# EasyEDA Pro project pro.epro

# Schematic Line follower
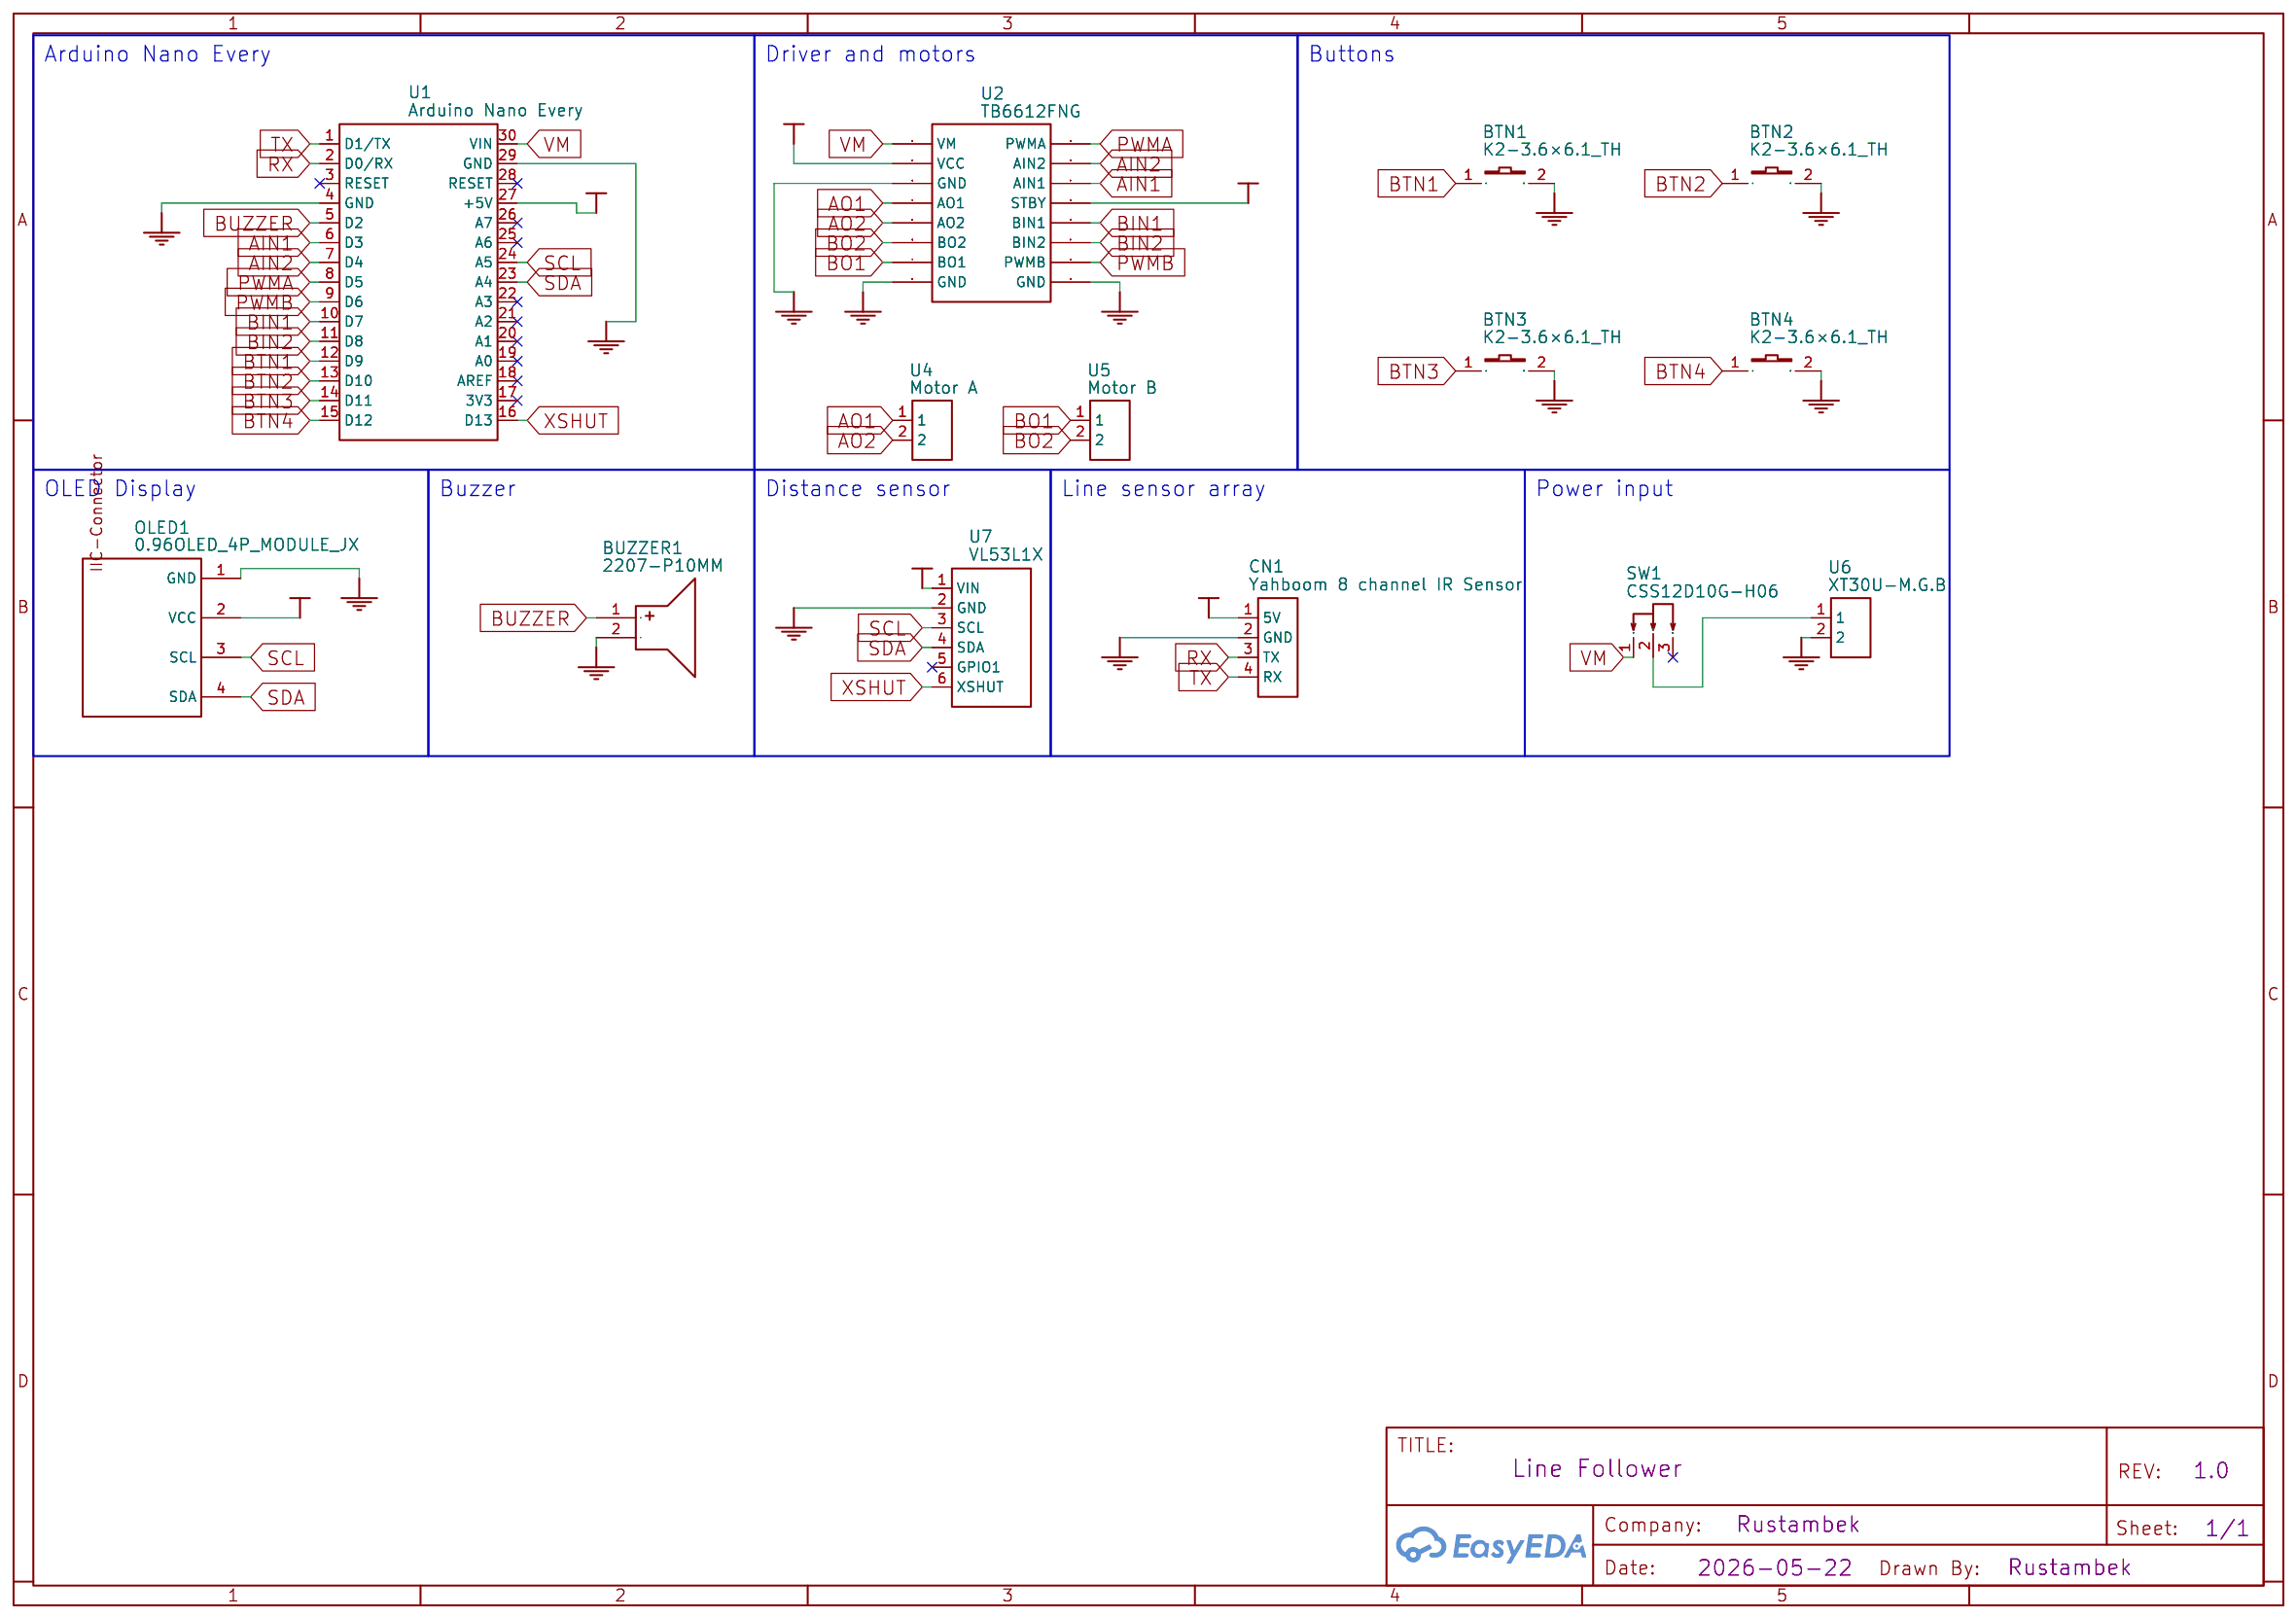
[diagram p0: schematic sheet]

## Parts
BTN1  K2-3.6×6.1_TH  [KEY-TH_2P]
BTN2  K2-3.6×6.1_TH  [KEY-TH_2P]
BTN3  K2-3.6×6.1_TH  [KEY-TH_2P]
BTN4  K2-3.6×6.1_TH  [KEY-TH_2P]
BUZZER1  2207-P10MM  [BUZZER_BEEPER:BUZZER_12X9.5RM7.6]
CN1  Yahboom 8 channel IR Sensor  [CONN-TH_PH2.0-4P]
OLED1  0.96OLED_4P_MODULE_JX  [0.96OLED_4P]
SW1  CSS12D10G-H06  [SW-TH_3P-P4.80-HX-SS12D10G4]
U1  Arduino Nano Every  [COMM-TH_ARDUINO_NANO]
U2  TB6612FNG  [TB6612-BOARD]
U4  Motor A  [CONN-TH_2P-P2.50-XH2.54-2P]
U5  Motor B  [CONN-TH_2P-P2.50-XH2.54-2P]
U6  XT30U-M.G.B  [CONN-TH_XT30U-M]
U7  VL53L1X  [CONN-TH_B6B-XH-A-GU]

## Library data of the parts
BTN1-BTN4 = K2-1107ST-A4SW-06: Supplier Part: C118141; Supplier: LCSC; 制造商: 韩国韩荣
BUZZER1 = 2207-P10MM: Supplier: LCSC; Supplier Part: C49246969; Manufacturer: XHXDZ(兴华鑫); JLCPCB Part Class: Extended Part
CN1 = PH2.0-4P: Supplier: LCSC; Supplier Part: C722763; Manufacturer: CAX(创都); JLCPCB Part Class: Extended Part
OLED1 = 0.96OLED_4P_MODULE_JX: Supplier: LCSC; Supplier Part: C9900004566; Manufacturer: null; JLCPCB Part Class: Extended Part
SW1 = CSS12D10G-H06: Supplier: LCSC; Supplier Part: C49435501; Manufacturer: JXTCONN(聚兴泰); JLCPCB Part Class: Extended Part; Origin 3D Model Title: SW-TH_SHOU-HAN_SS12D10G4
U1 = ARDUINO_NANO: Supplier: LCSC; Supplier Part: C9900017879; Manufacturer: null; JLCPCB Part Class: Extended Part
U2 = TB6612FNG
U4 U5 = XH-2P-2.54: Supplier: LCSC; Supplier Part: C9900003929; Manufacturer: null; JLCPCB Part Class: Extended Part
U6 = XT30U-M.G.B: Supplier: LCSC; Supplier Part: C19268020; Manufacturer: AMASS(艾迈斯); JLCPCB Part Class: Extended Part
U7 = B6B-XH-A-GU: Supplier: LCSC; Supplier Part: C265366; Manufacturer: JST; JLCPCB Part Class: Extended Part

## Nets
GND: BTN1.2 BTN2.2 BTN3.2 BTN4.2 BUZZER1.2(-) CN1.2(GND) OLED1.1(GND) U1.4(GND) U1.29(GND) U2.3(GND) U2.8(GND) U2.9(GND) U6.2 U7.2(GND)
VCC: CN1.1(5V) OLED1.2(VCC) U1.27(+5V) U2.2(VCC) U2.13(STBY) U7.1(VIN)
AIN1: U1.6(D3) U2.14(AIN1)
AIN2: U1.7(D4) U2.15(AIN2)
AO1: U2.4(AO1) U4.1
AO2: U2.5(AO2) U4.2
BIN1: U1.10(D7) U2.12(BIN1)
BIN2: U1.11(D8) U2.11(BIN2)
BO1: U2.7(BO1) U5.1
BO2: U2.6(BO2) U5.2
BTN1: BTN1.1 U1.12(D9)
BTN2: BTN2.1 U1.13(D10)
BTN3: BTN3.1 U1.14(D11)
BTN4: BTN4.1 U1.15(D12)
BUZZER: BUZZER1.1(+) U1.5(D2)
PWMA: U1.8(D5) U2.16(PWMA)
PWMB: U1.9(D6) U2.10(PWMB)
RX: CN1.3(TX) U1.2(D0/RX)
SCL: OLED1.3(SCL) U1.24(A5) U7.3(SCL)
SDA: OLED1.4(SDA) U1.23(A4) U7.4(SDA)
TX: CN1.4(RX) U1.1(D1/TX)
VM: SW1.1 U1.30(VIN) U2.1(VM)
XSHUT: U1.16(D13) U7.6(XSHUT)
Net-(SW1-2): SW1.2 U6.1

Not connected (* = marked no-connect by the designer): SW1 3*; U1 3(RESET)* 17(3V3)* 18(AREF)* 19(A0)* 20(A1)* 21(A2)* 22(A3)* 25(A6)* 26(A7)* 28(RESET)*; U7 5(GPIO1)*

## Notes on the sheet
- Arduino Nano Every
- Driver and motors
- Buttons
- OLED Display
- Buzzer
- Distance sensor
- Line sensor array
- Power input

# Board pcb
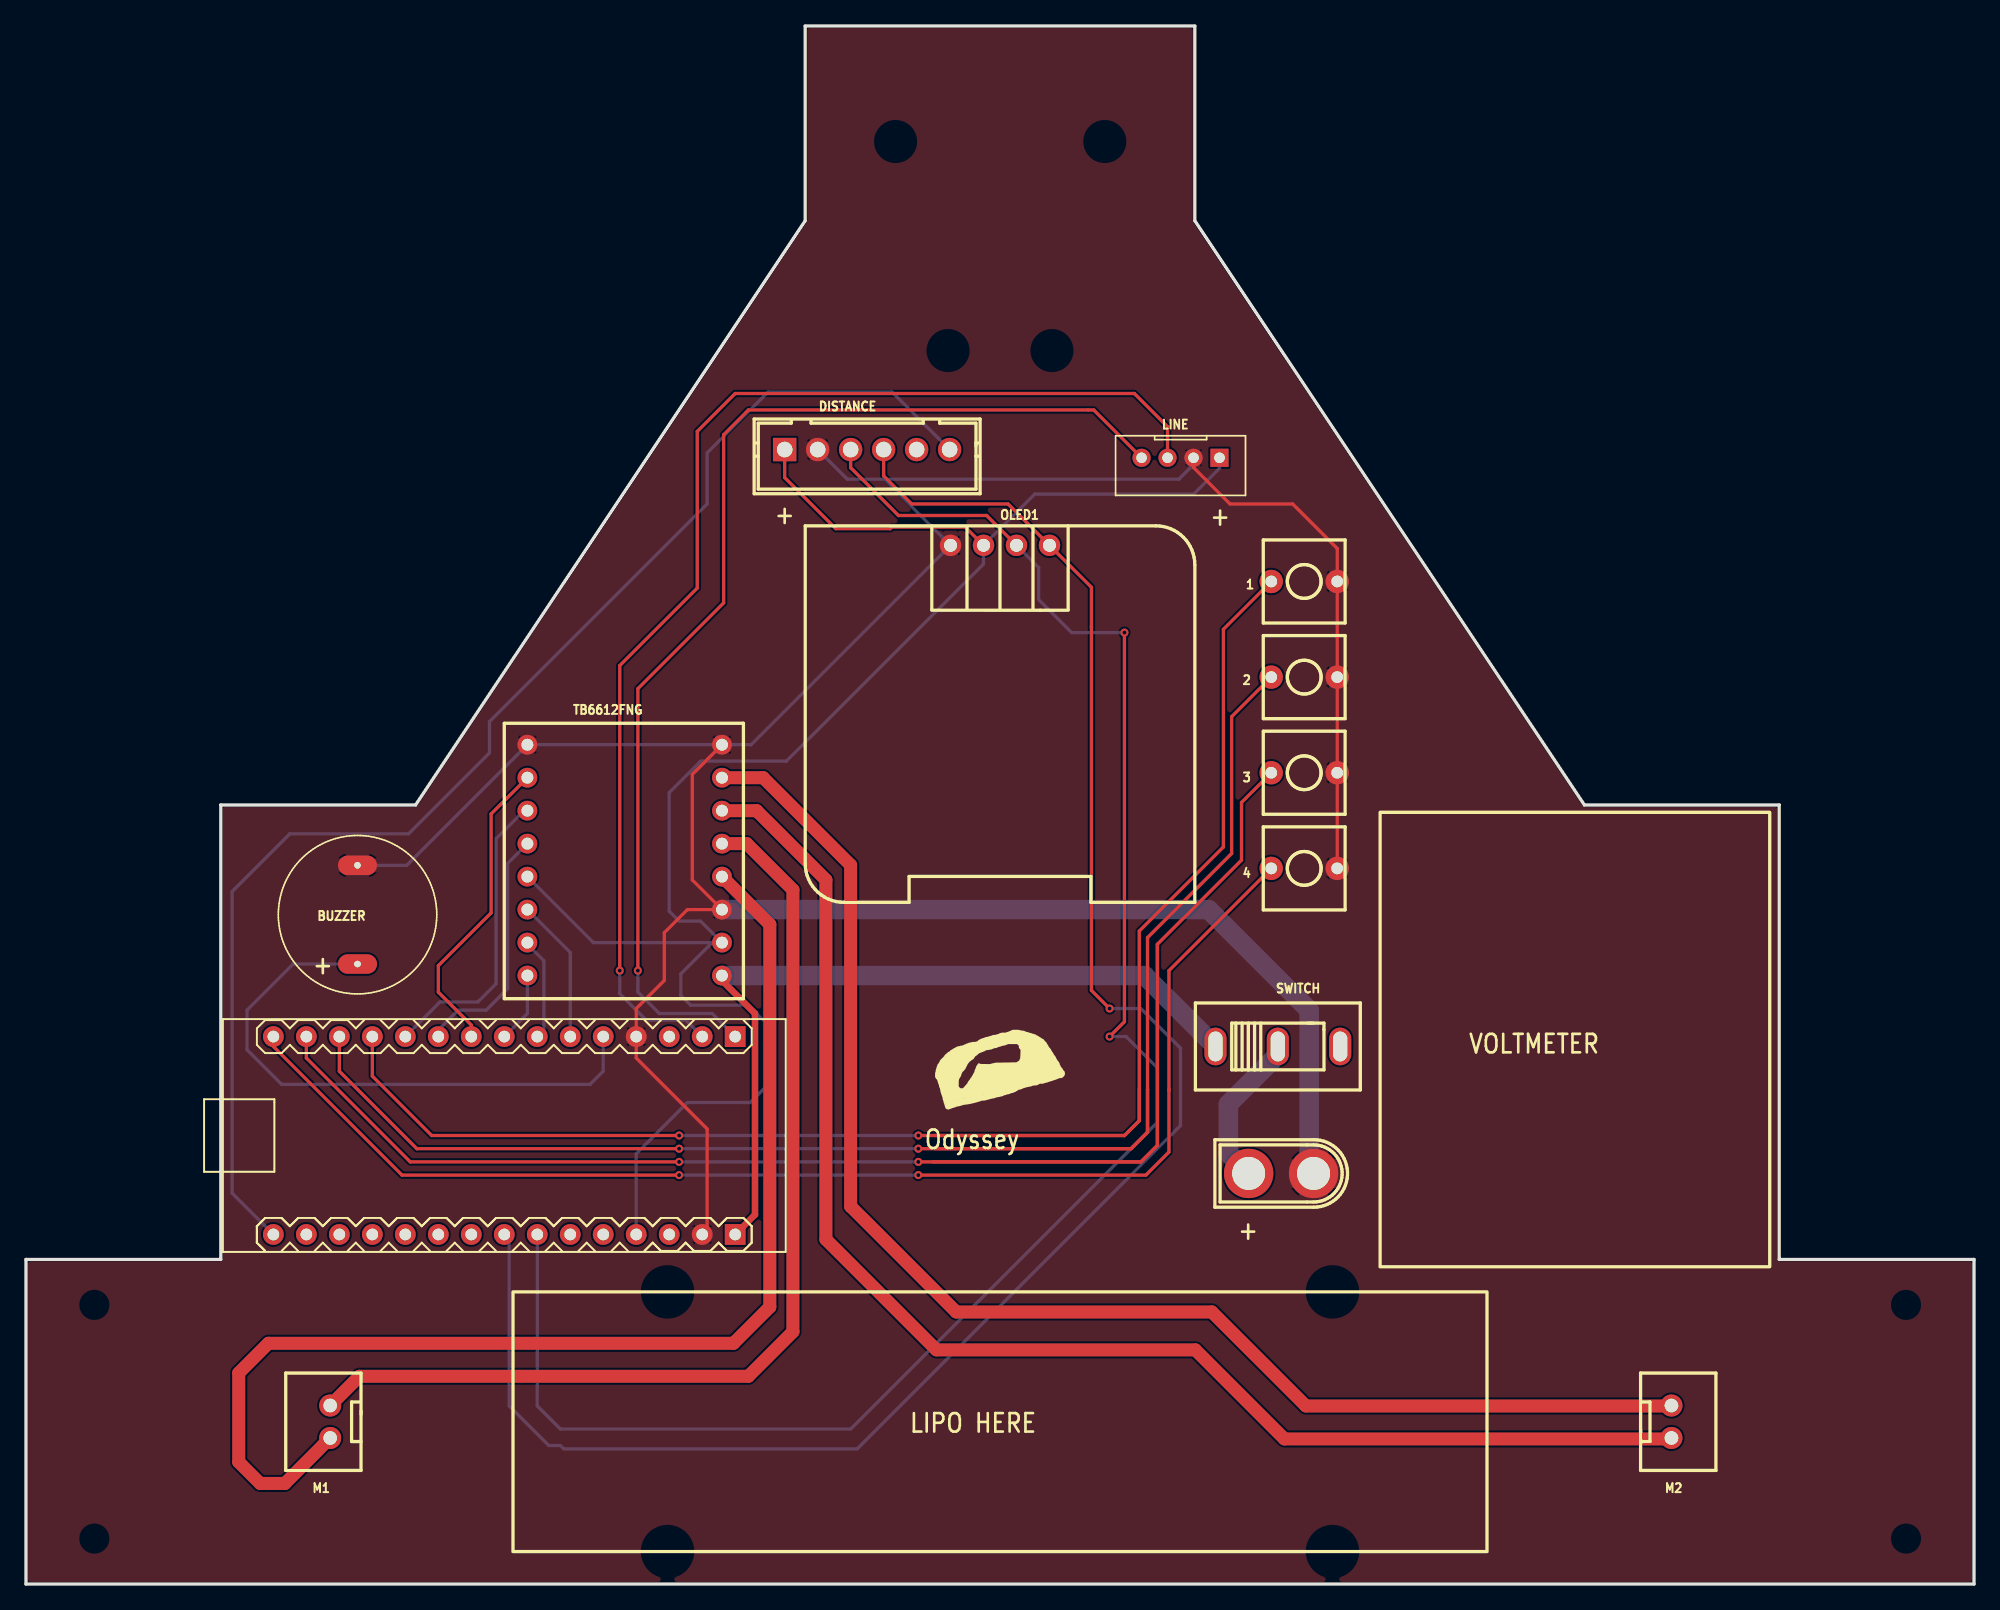
[diagram p1: board, top side]
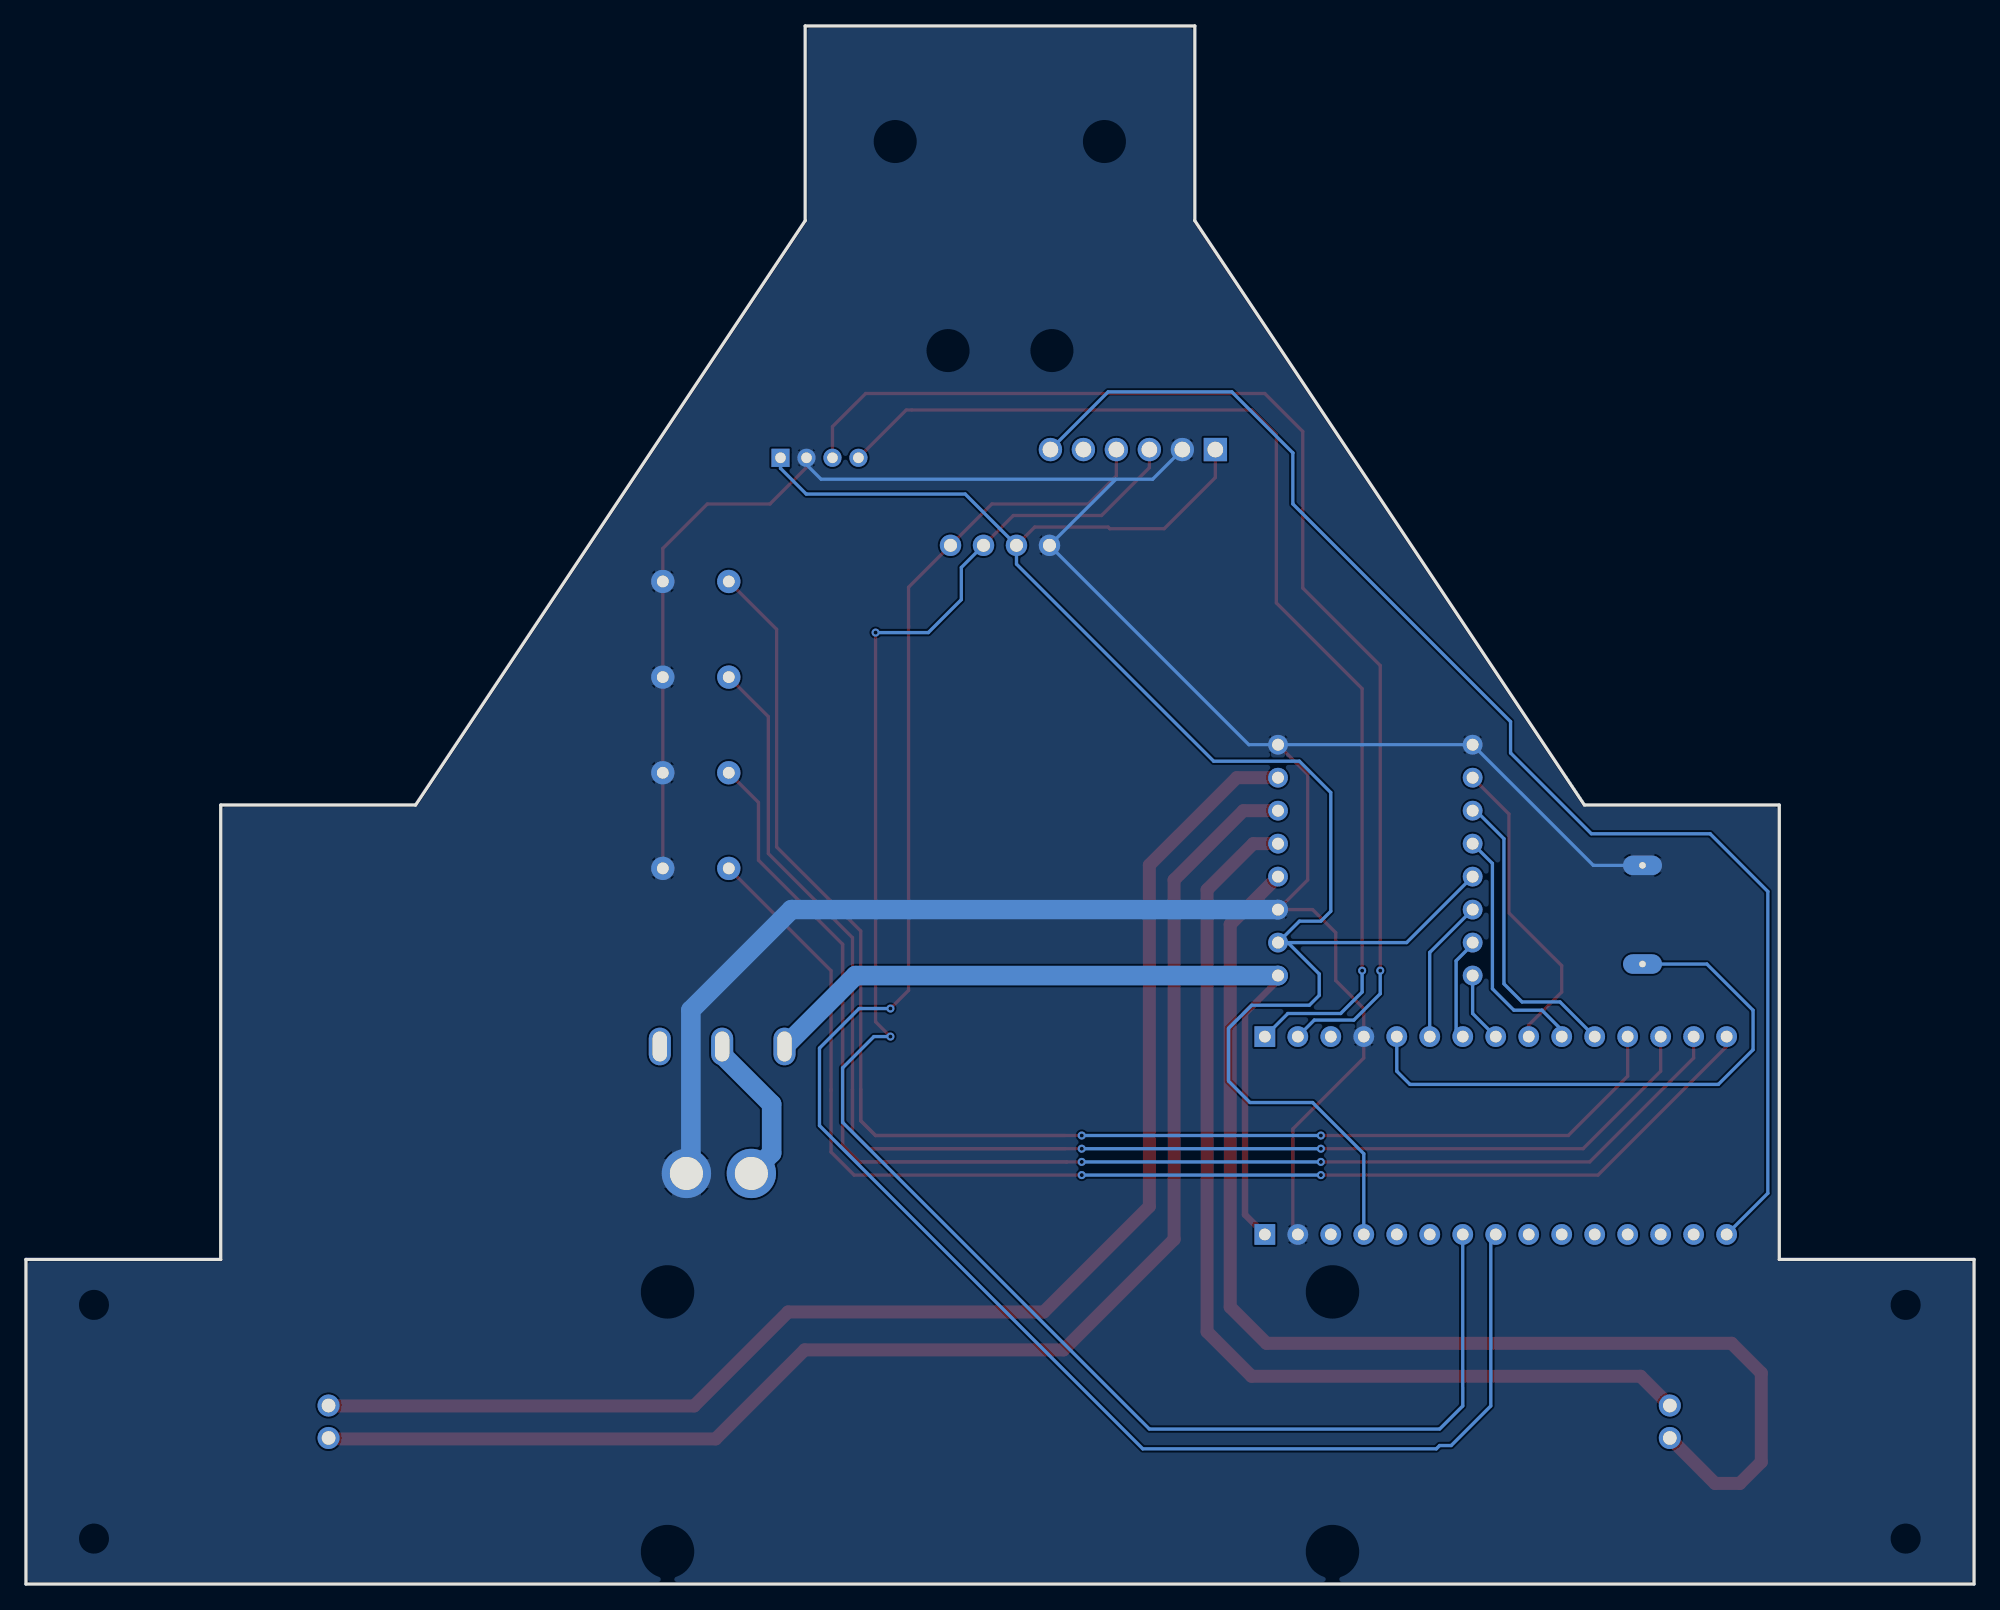
[diagram p2: board, bottom side, seen from below]

Outline 150 x 120 mm; copper layers: Top Layer, Bottom Layer. Coordinates in mm from the lower left corner of the outline.
Outline path: 0,25 0,0 150,0 150,25 135,25 135,60 120,60 90,105 90,120 60,120 60,105 30,60 15,60 15,25 0,25
Stack: Top Layer 0.035mm / Bottom Layer 0.035mm

## Design rules (mm)
spacing Default (default): track to track 0.102, other pairs 0 to 0.3
spacing Lipo: track to track 0.102, other pairs 0 to 0.3
spacing Motor: track to track 0.102, other pairs 0 to 0.3
track width Default (default): min 0.254, default 0.254, max 25.4
track width Lipo: min 1.5, default 1.5, max 25.4
track width Motor: min 1, default 1, max 25.4
differential pair differentialPair (default): width min 0.127, default 2.54, max 2.54; gap min 0.127, default 0.152

## Placement (name value [footprint] x y rotation side)
1  K2-3.6×6.1_TH  [KEY-TH_2P]  98.42 77.22 0 top
2  K2-3.6×6.1_TH  [KEY-TH_2P]  98.42 69.85 0 top
3  K2-3.6×6.1_TH  [KEY-TH_2P]  98.42 62.48 0 top
4  K2-3.6×6.1_TH  [KEY-TH_2P]  98.42 55.12 0 top
BUZZER  2207-P10MM  [BUZZER_BEEPER:BUZZER_12X9.5RM7.6]  25.53 47.75 90 top
DISTANCE  VL53L1X  [CONN-TH_B6B-XH-A-GU]  64.77 87.38 180 top
LINE  Yahboom 8 channel IR Sensor  [CONN-TH_PH2.0-4P]  88.9 86.74 180 top
M1  Motor A  [CONN-TH_2P-P2.50-XH2.54-2P]  23.42 12.5 270 top
M2  Motor B  [CONN-TH_2P-P2.50-XH2.54-2P]  126.7 12.5 90 top
OLED1  0.96OLED_4P_MODULE_JX  [0.96OLED_4P]  75 80 0 top
SWITCH  CSS12D10G-H06  [SW-TH_3P-P4.80-HX-SS12D10G4]  96.39 41.4 0 top
TB6612FNG  TB6612FNG  [TB6612-BOARD]  51.05 46.86 180 top
U1  Arduino Nano Every  [COMM-TH_ARDUINO_NANO]  36.83 34.54 0 top
U6  XT30U-M.G.B  [CONN-TH_XT30U-M]  96.65 31.62 0 top

## Footprints (pads in the part's own frame, mm; a bottom-side part is the same pattern mirrored in y, then rotated)
0.96OLED_4P
  round 1.65 hole 1: 1(-3.81,-0.002) 2(-1.27,0.002) 3(1.27,0.002) 4(3.81,0.002)
BUZZER_BEEPER:BUZZER_12X9.5RM7.6
  oval 1.5x3 hole 0.5x0.505: 1(0,0) 2(7.6,0)
COMM-TH_ARDUINO_NANO
  rect 1.6x1.6 hole 0.9: 1(17.78,7.62) 30(17.78,-7.62)
  round 1.6 hole 0.9: 2(15.24,7.62) 3(12.7,7.62) 4(10.16,7.62) 5(7.62,7.62) 6(5.08,7.62) 7(2.54,7.62) 8(0,7.62) 9(-2.54,7.62) 10(-5.08,7.62) 11(-7.62,7.62) 12(-10.16,7.62) 13(-12.7,7.62) 14(-15.24,7.62) 15(-17.78,7.62) 16(-17.78,-7.62) 17(-15.24,-7.62) 18(-12.7,-7.62) 19(-10.16,-7.62) 20(-7.62,-7.62) 21(-5.08,-7.62) 22(-2.54,-7.62) 23(0,-7.62) 24(2.54,-7.62) 25(5.08,-7.62) 26(7.62,-7.62) 27(10.16,-7.62) 28(12.7,-7.62) 29(15.24,-7.62)
CONN-TH_2P-P2.50-XH2.54-2P
  round 1.7 hole 1.05: 1(1.25,0) 2(-1.25,0)
CONN-TH_B6B-XH-A-GU
  rect 1.8x1.8 hole 1.2: 1(6.35,0)
  round 1.8 hole 1.2: 2(3.81,0) 3(1.27,0) 4(-1.27,0) 5(-3.81,0) 6(-6.35,0)
CONN-TH_PH2.0-4P
  rect 1.4x1.4 hole 0.813: 1(-3,0)
  round 1.4 hole 0.813: 2(-1,0) 3(1,0) 4(3,0)
CONN-TH_XT30U-M
  round 3.8 hole 2.54: 1(-2.5,0) 2(2.5,0)
KEY-TH_2P
  round 1.8 hole 0.905x0.9: 1(-2.54,0) 2(2.54,0)
SW-TH_3P-P4.80-HX-SS12D10G4
  oval 1.7x2.9 hole 1.1x2.3: 1(-4.8,0) 2(0,0) 3(4.8,0)
TB6612-BOARD
  round 1.524 hole 0.914: 1(-2.54,0) 2(-2.54,-2.54) 3(-2.54,-5.08) 4(-2.54,-7.62) 5(-2.54,-10.16) 6(-2.54,-12.7) 7(-2.54,-15.24) 8(-2.54,-17.78) 9(12.446,-17.78) 10(12.446,-15.24) 11(12.446,-12.7) 12(12.446,-10.16) 13(12.446,-7.62) 14(12.446,-5.08) 15(12.446,-2.54) 16(12.446,0)

## Nets
GND: 1.2 2.2 3.2 4.2 BUZZER.2 DISTANCE.2 LINE.2 OLED1.1 TB6612FNG.3 TB6612FNG.8 TB6612FNG.9 U1.4 U1.29 U6.2
VCC: DISTANCE.1 LINE.1 OLED1.2 TB6612FNG.2 TB6612FNG.13 U1.27
AIN1: TB6612FNG.14 U1.6
AIN2: TB6612FNG.15 U1.7
AO1: M1.1 TB6612FNG.4
AO2: M1.2 TB6612FNG.5
BIN1: TB6612FNG.12 U1.10
BIN2: TB6612FNG.11 U1.11
BO1: M2.1 TB6612FNG.7
BO2: M2.2 TB6612FNG.6
BTN1: 1.1 U1.12
BTN2: 2.1 U1.13
BTN3: 3.1 U1.14
BTN4: 4.1 U1.15
BUZZER: BUZZER.1 U1.5
PWMA: TB6612FNG.16 U1.8
PWMB: TB6612FNG.10 U1.9
RX: LINE.3 U1.2
SCL: DISTANCE.3 OLED1.3 U1.24
SDA: DISTANCE.4 OLED1.4 U1.23
TX: LINE.4 U1.1
U6_1: SWITCH.2 U6.1
VM: SWITCH.1 TB6612FNG.1 U1.30
XSHUT: DISTANCE.6 U1.16

Pads without a net: DISTANCE 5; SWITCH 3; U1 3 17 18 19 20 21 22 25 26 28

## Via types
v1: diameter 0.62, hole 0.31, Top Layer to Bottom Layer, 13 vias

## Routing (per net, layer and track width the routed paths; a pad name or vN(x,y) marks a point on that pad's centre or on a via; arc(x,y) is an arc through that point)
GND: length 240.5
  Top Layer w0.254: 52.07,26.92 52.45,27.31 52.45,35.05 46.99,40.51 46.99,42.16 46.99,44.32 49.15,46.48 49.15,50.17 50.93,51.94 53.59,51.94 51.31,54.23 51.31,62.36 53.59,64.64 ; LINE.2 89.9,86 92.71,83.19 97.54,83.19 100.97,79.76 1.2 2.2 3.2 4.2
  Bottom Layer w0.254: 60.96,87.38 63.25,85.09 88.77,85.09 89.9,86.22 LINE.2 ; 71.19,80 55.83,64.64 38.61,64.64 ; TB6612FNG.9 29.32,55.35 BUZZER.2 ; 71.19,80 66.08,85.09
  Bottom Layer w1.5: 53.59,51.94 91.06,51.94 98.81,44.2 98.81,31.96 U6.2
VCC: length 142.3
  Top Layer w0.254: 58.42,87.38 58.42,85.22 62.36,81.28 66.55,81.28 66.67,81.41 72.32,81.41 OLED1.2
  Bottom Layer w0.254: U1.27 46.99,33.15 50.93,37.08 55.75,37.08 57.4,38.73 57.4,42.8 55.62,44.58 51.18,44.58 50.42,45.34 50.42,46.99 52.83,49.4 53.6,49.4 ; LINE.1 91.9,85.93 89.92,83.95 77.68,83.95 OLED1.2 73.73,78.56 58.55,63.37 51.94,63.37 49.53,60.96 49.53,51.82 50.29,51.05 51.94,51.05 53.59,49.4 43.69,49.4 38.61,54.48
AIN1: length 11.1
  Bottom Layer w0.254: 38.61,51.94 41.91,48.64 41.91,42.16
AIN2: length 8
  Bottom Layer w0.254: 38.61,49.4 38.61,49.28 39.88,48.01 39.88,42.67 39.37,42.16
AO1: length 93.7
  Top Layer w1: M1.1 19.94,7.75 18.03,7.75 16.38,9.4 16.38,16.26 18.67,18.54 54.48,18.54 57.28,21.34 57.28,50.8 53.6,54.48
AO2: length 79
  Top Layer w1: 23.42,13.75 25.68,16 55.63,16 59.06,19.43 59.06,53.47 55.5,57.02 53.59,57.02
BIN1: length 19
  Bottom Layer w0.254: 38.61,57.02 37.08,55.5 37.08,45.85 35.43,44.2 33.27,44.2 31.75,42.67 31.75,42.16
BIN2: length 23.2
  Bottom Layer w0.254: 38.61,59.56 38.35,59.56 36.19,57.4 36.19,46.23 34.8,44.83 31.88,44.83 29.21,42.16
BO1: length 108.6
  Top Layer w1: 53.59,62.1 56.77,62.1 63.5,55.37 63.5,29.08 71.63,20.96 91.31,20.96 98.55,13.72 126.67,13.72 126.7,13.75
BO2: length 109.4
  Top Layer w1: 126.7,11.25 126.63,11.18 96.9,11.18 90.04,18.03 70.1,18.03 61.59,26.54 61.59,54.23 56.26,59.56 53.59,59.56
BTN1: length 128.8
  Top Layer w0.254: 85.72,38.1 85.72,35.69 ; 85.72,38.1 85.72,50.29 92.2,56.77 92.2,73.53 95.89,77.22 ; 85.72,38.1 85.72,35.69 ; 85.72,35.69 84.58,34.54 ; 85.72,35.69 84.58,34.54 ; 26.67,42.16 26.67,39.12 31.24,34.54 v1(50.29,34.54) ; 84.58,34.54 69.98,34.54 ; 84.58,34.54 68.71,34.54
  Bottom Layer w0.254: 68.71,34.54 v1(50.29,34.54)
  vias: v1(68.71,34.54)
BTN2: length 127.1
  Top Layer w0.254: 95.89,69.85 92.84,66.8 92.84,56.26 86.36,49.78 86.36,38.1 ; v1(50.29,33.53) 30.1,33.53 24.13,39.5 24.13,42.16 ; 85.09,33.53 68.71,33.53 ; 85.09,33.53 86.36,34.8 ; 85.09,33.53 69.98,33.53 ; 85.09,33.53 86.36,34.8 ; 86.36,34.8 86.36,38.1 ; 86.36,34.8 86.36,38.1
  Bottom Layer w0.254: 68.71,33.53 v1(50.29,33.53)
  vias: v1(68.71,33.53)
BTN3: length 136.6
  Top Layer w0.254: 87.12,33.78 85.85,32.51 ; 87.12,33.78 87.12,49.28 ; 87.12,33.78 85.85,32.51 ; 87.12,33.78 87.12,49.28 ; 85.85,32.51 69.85,32.51 ; 85.85,32.51 69.85,32.51 ; 69.85,32.51 68.71,32.51 ; 21.59,42.16 21.59,40.51 29.59,32.51 v1(50.29,32.51) ; 95.89,62.48 93.6,60.2 93.6,55.75 87.12,49.28
  Bottom Layer w0.254: 68.71,32.51 v1(50.29,32.51)
  vias: v1(68.71,32.51)
BTN4: length 99.8
  Top Layer w0.254: v1(50.29,31.5) 28.95,31.5 19.05,41.4 19.05,42.16 ; 88.01,37.97 88.01,47.24 4.1 ; v1(68.71,31.5) 86.23,31.5 88.01,33.27 88.01,38.1
  Bottom Layer w0.254: v1(68.71,31.5) v1(50.29,31.5)
BUZZER: length 44.7
  Bottom Layer w0.254: BUZZER.1 20.57,47.75 17.02,44.2 17.02,41.15 19.69,38.48 43.43,38.48 44.45,39.5 U1.5
PWMA: length 5.4
  Bottom Layer w0.254: 36.83,42.16 38.61,43.94 38.61,46.86
PWMB: length 23.8
  Top Layer w0.254: 38.61,62.1 35.81,59.31 35.81,51.69 31.75,47.62 31.75,45.59 34.29,43.05 34.29,42.16
RX: length 94.4
  Top Layer w0.254: LINE.3 87.9,89.14 85.34,91.69 54.61,91.69 51.69,88.77 51.69,76.71 45.72,70.74 v1(45.72,47.24)
  Bottom Layer w0.254: 52.07,42.16 50.8,43.43 47.75,43.43 45.72,45.47 v1(45.72,47.24)
SCL: length 141.1
  Top Layer w0.254: OLED1.3 73.97,82.3 67.18,82.3 63.5,85.98 63.5,87.38 ; v1(84.58,73.28) 84.58,43.31 v1(83.44,42.16)
  Bottom Layer w0.254: OLED1.3 77.98,78.29 77.98,75.82 80.52,73.28 v1(84.58,73.28) ; 39.37,26.92 39.37,13.72 41.15,11.94 63.5,11.94 87.12,35.56 87.12,39.75 84.71,42.16 v1(83.44,42.16)
SDA: length 144.2
  Top Layer w0.254: 82.04,73.66 82.04,76.77 OLED1.4 75.63,83.19 68.2,83.19 66.04,85.34 66.04,87.38 ; 82.04,73.79 82.04,45.72 v1(83.44,44.32)
  Bottom Layer w0.254: v1(83.44,44.32) 85.85,44.32 88.9,41.28 88.9,35.31 64.01,10.41 41.4,10.41 41.15,10.67 40.26,10.67 37.21,13.72 37.21,26.54 36.83,26.92
TX: length 89.1
  Top Layer w0.254: LINE.4 82.22,90.42 55.62,90.42 53.72,88.52 53.72,75.56 47.12,68.96 v1(47.12,47.24)
  Bottom Layer w0.254: v1(47.12,47.24) 47.12,45.59 48.77,43.94 52.83,43.94 54.61,42.16
U6_1: length 12
  Bottom Layer w1.5: 96.39,41.4 96.39,40.77 92.58,36.96 92.58,33.19 U6.1
VM: length 61.9
  Top Layer w0.5: 53.59,46.86 53.59,46.48 56.13,43.94 56.13,28.45 54.61,26.92
  Bottom Layer w1.5: 91.59,41.4 86.13,46.86 53.59,46.86
XSHUT: length 104.5
  Bottom Layer w0.254: 71.12,87.38 66.67,91.82 57.15,91.82 52.45,87.12 52.45,83.19 35.69,66.42 35.69,64.01 29.46,57.78 20.32,57.78 15.88,53.34 15.88,30.1 19.05,26.92

## Copper pours and planes (outline as drawn; the poured copper is in the pictures)
GND on Top Layer: 0,0 0,119.13 -1.52,120.65 152.4,120.65 152.65,120.9 152.65,0.13 152.53,0
GND on Top Layer: 29.97,60.07 29.08,60.96 27.05,60.96 26.16,60.07
GND on Bottom Layer: 0,0 0,120.65 152.65,120.65 152.65,0.13

Small or netless copper shapes (teardrops, artwork), in the pictures only: 1 on Top Layer

## Text on the board
Top Silkscreen Layer: + | LIPO HERE | Odyssey | VOLTMETER
